# EAGLE schematic vga3 (EAGLE 7.3.0)
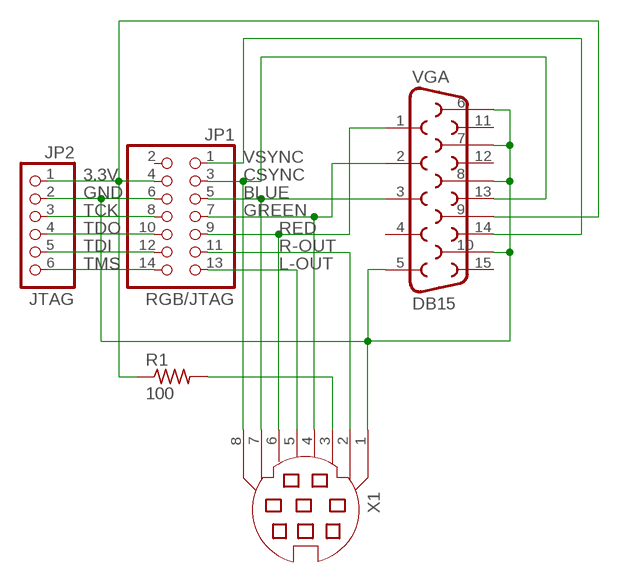
[diagram p0: schematic, sheet 1]

## Parts
JP1  RGB/JTAG  PINHD-2X7  [2X07]
JP2  JTAG  PINHD-1X6  [1X06]
R1  100  R-US_0204/7  [0204/7]
VGA  DB15  [DB15]
X1  MD08S  [MDIN08S]

## Nets
3.3V: JP1.4 JP2.1 R1.1 VGA.9
BLUE: JP1.5 VGA.3 X1.7
CSYNC: JP1.3 VGA.13 X1.8
GND: JP1.6 JP2.2 VGA.5 VGA.6 VGA.7 VGA.8 VGA.10 X1.1
GREEN: JP1.7 VGA.2 X1.4
L-OUT: JP1.13 X1.5
N$2: R1.2 X1.3
R-OUT: JP1.11 X1.2
RED: JP1.9 VGA.1 X1.6
TCK: JP1.8 JP2.3
TDI: JP1.12 JP2.5
TDO: JP1.10 JP2.4
TMS: JP1.14 JP2.6
VSYNC: JP1.1 VGA.14
Unconnected: JP1.2 VGA.4 VGA.11 VGA.12 VGA.15

## Library data of the parts
JP1 = pinhead:PINHD-2X7: PIN HEADER
JP2 = pinhead:PINHD-1X6: PIN HEADER
R1 = rcl:R-US_: RESISTOR, American symbol
VGA = SparkFun-Connectors:DB15: DB15 / VGA right angle through-hole female connector.
X1 = con-yamaichi:MD08S: YAMAICHI CONNECTOR; OC_FARNELL: unknown; OC_NEWARK: unknown